# Altium schematic sheet 0203_BLANK.SchDoc
size 848 x 558 mm
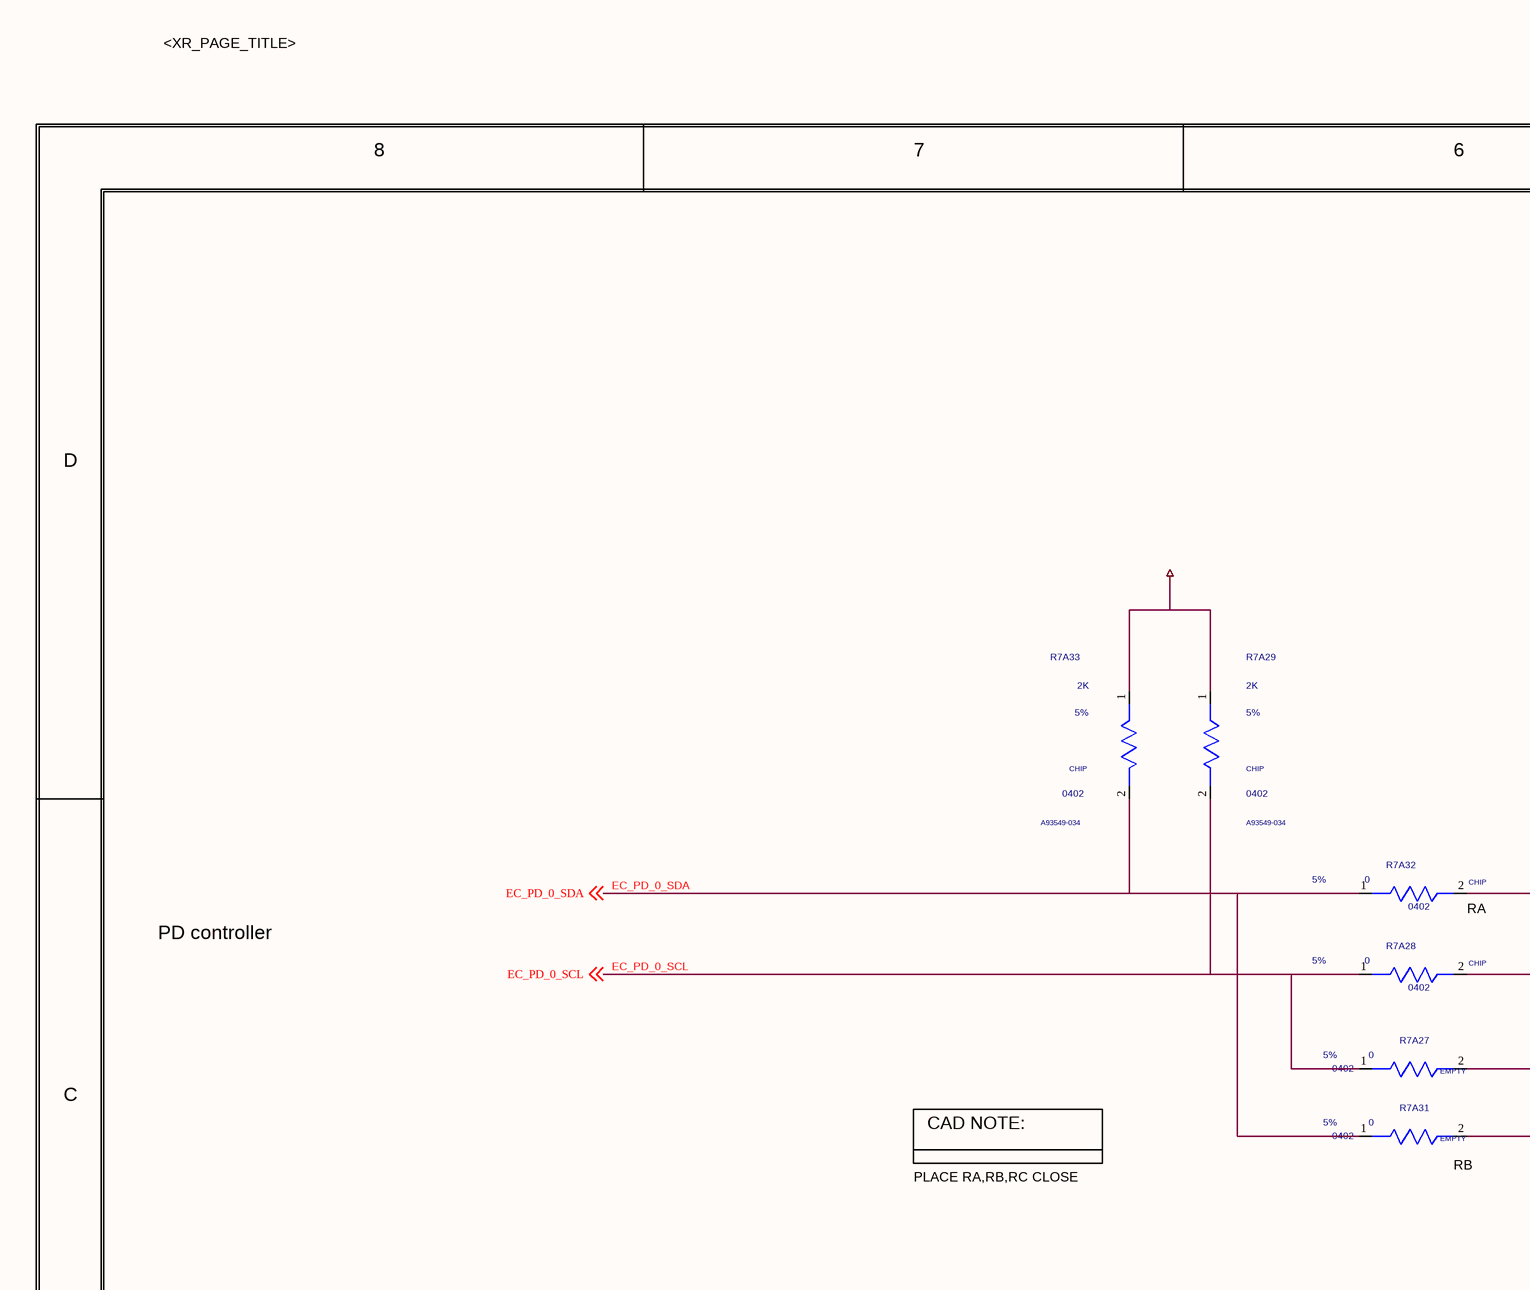
[diagram p0: 0203_BLANK.SchDoc, top left]
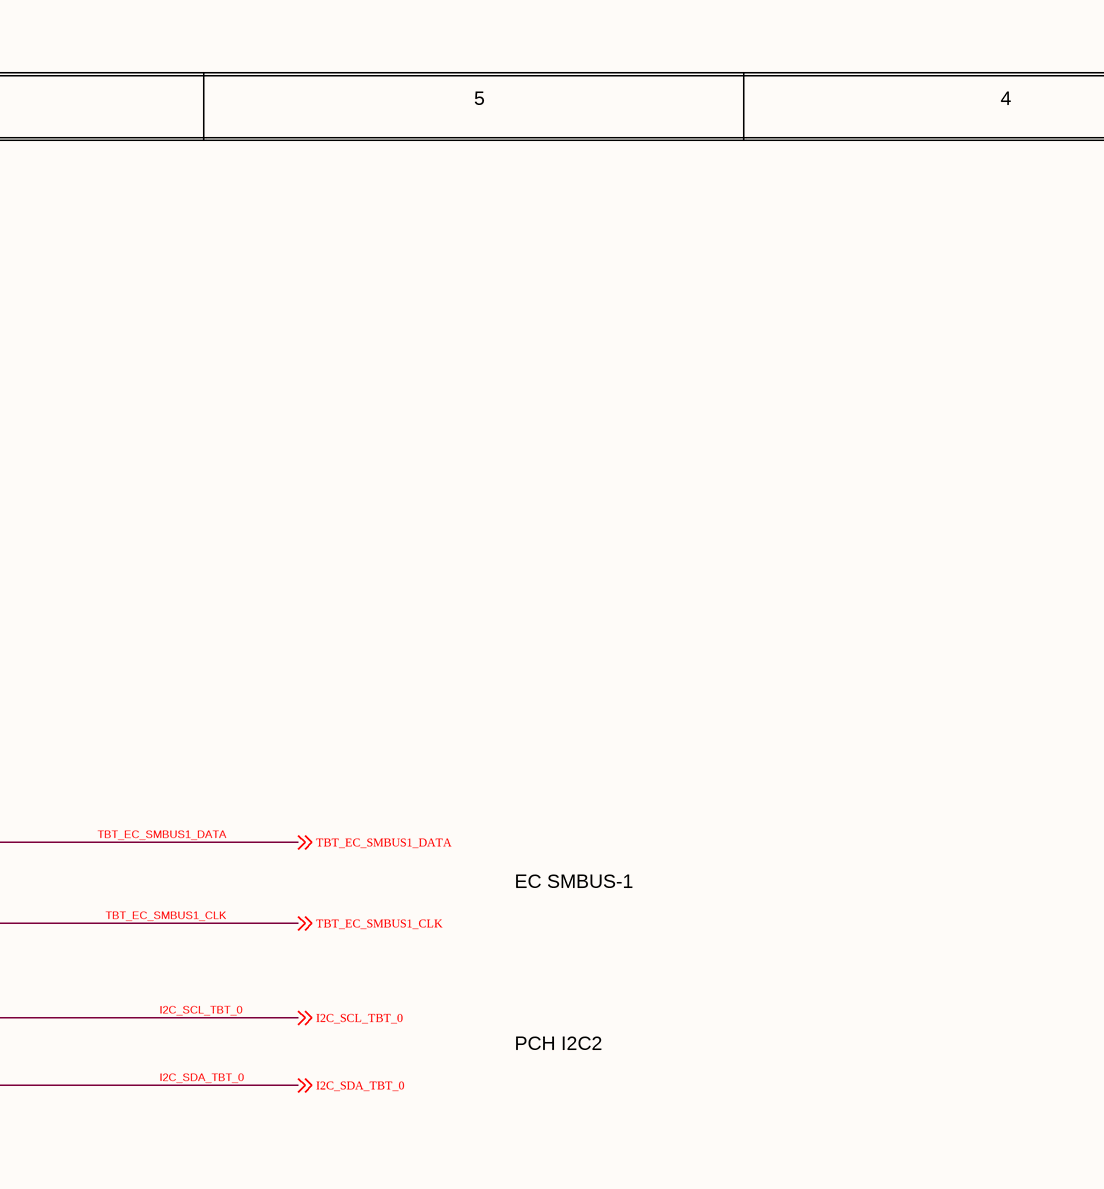
[diagram p1: 0203_BLANK.SchDoc, top middle]
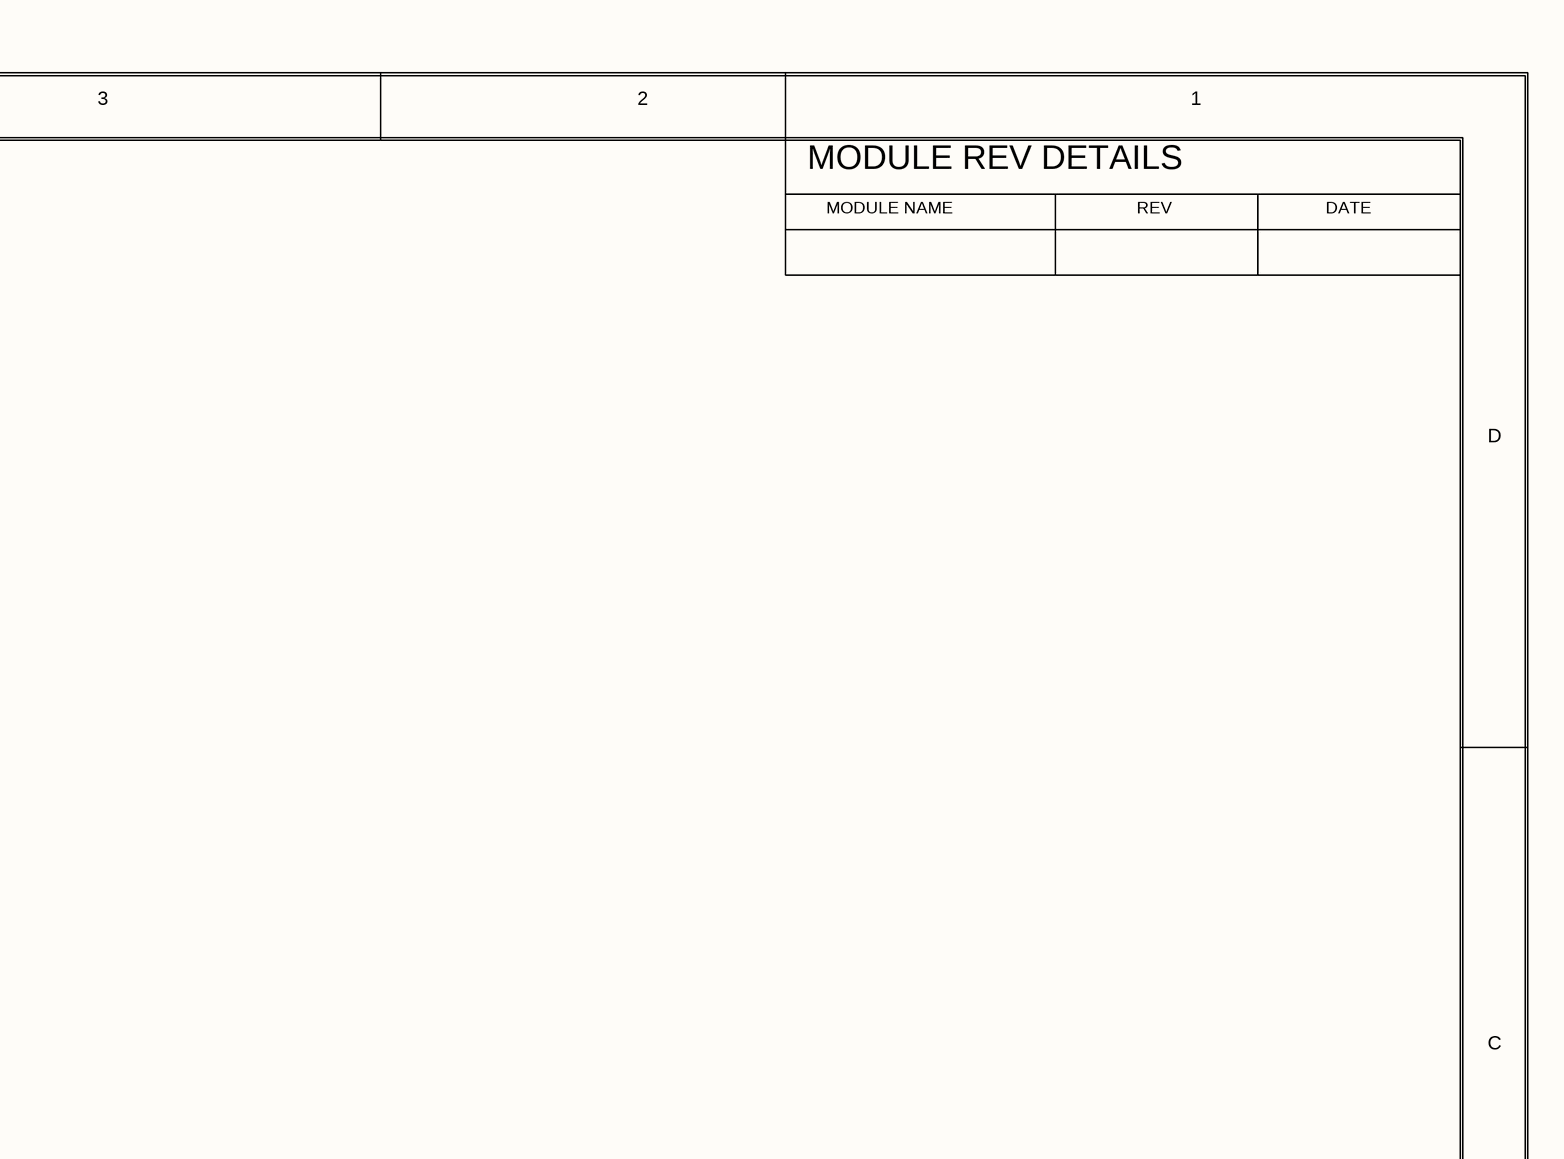
[diagram p2: 0203_BLANK.SchDoc, top right]
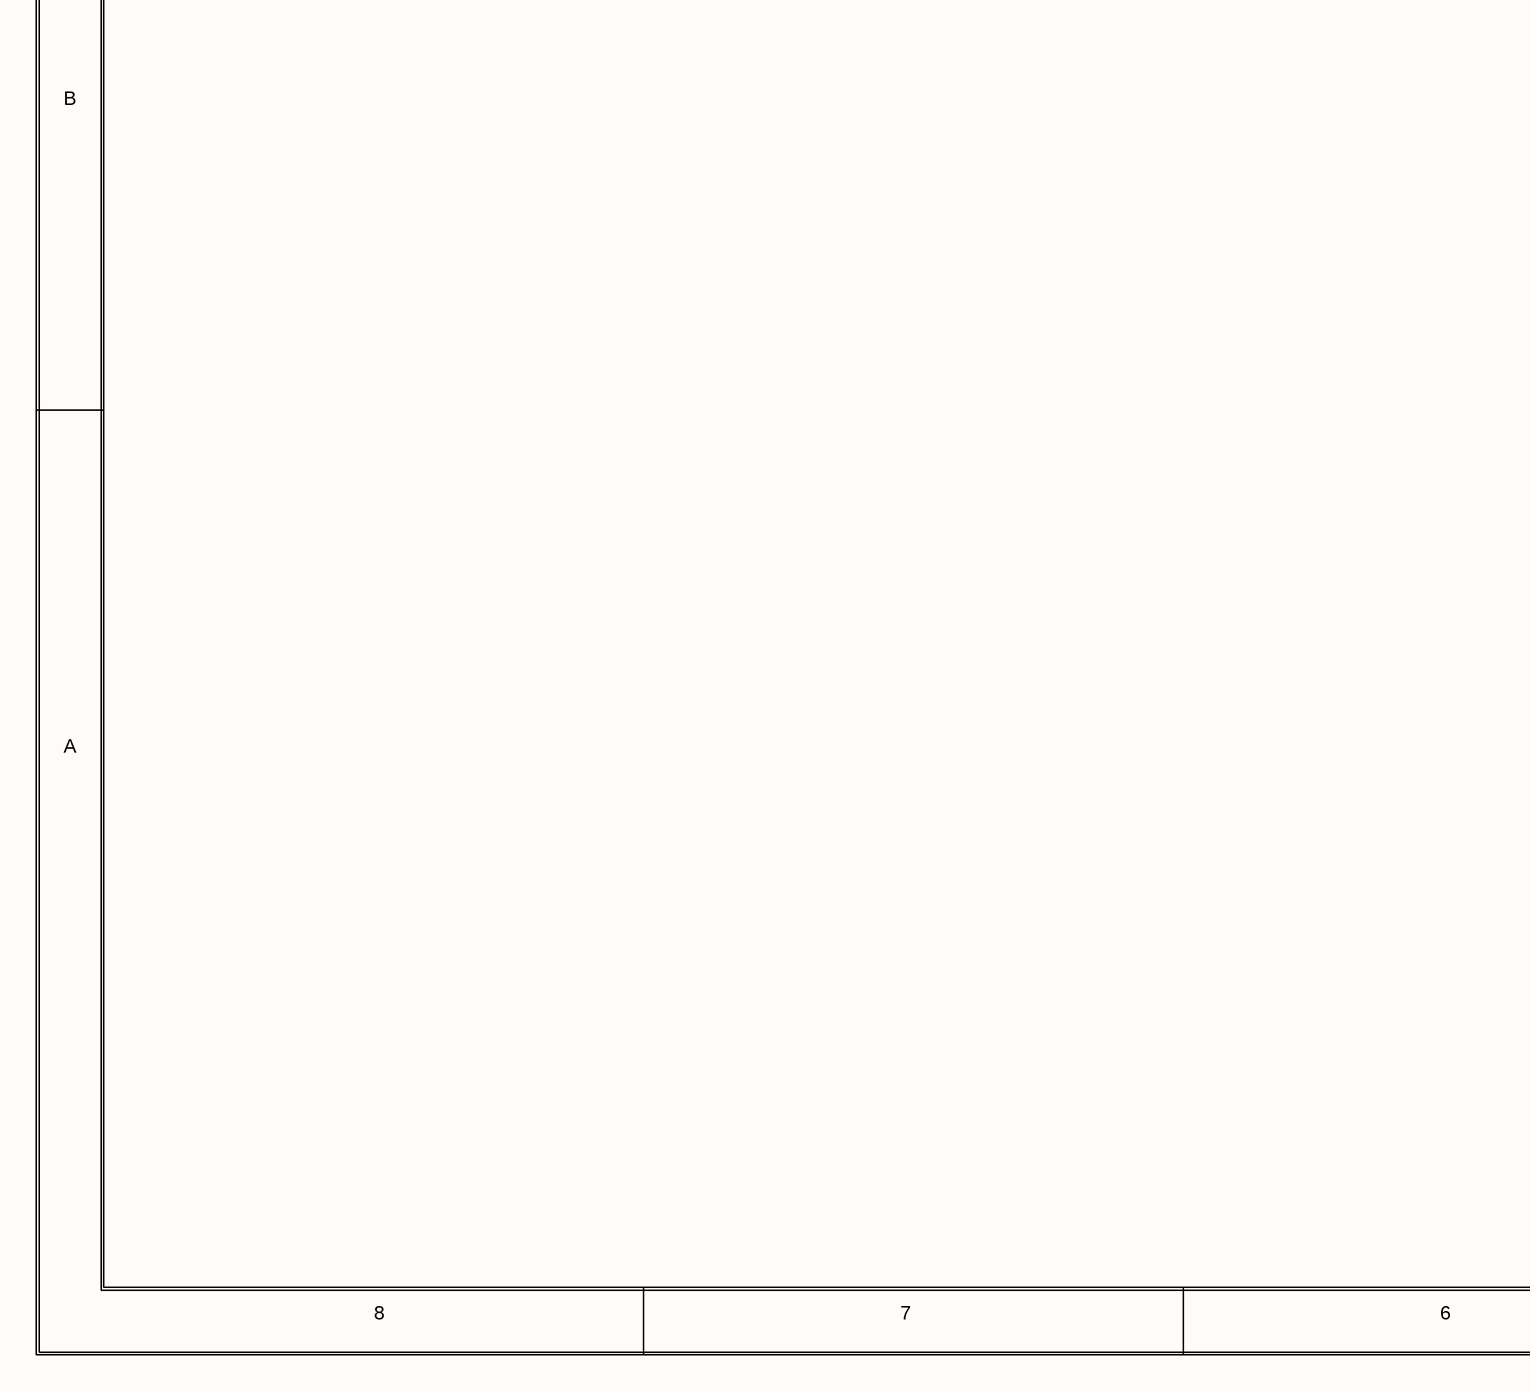
[diagram p3: 0203_BLANK.SchDoc, bottom left]
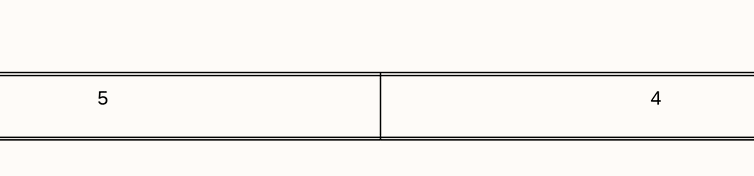
[diagram p4: 0203_BLANK.SchDoc, bottom middle]
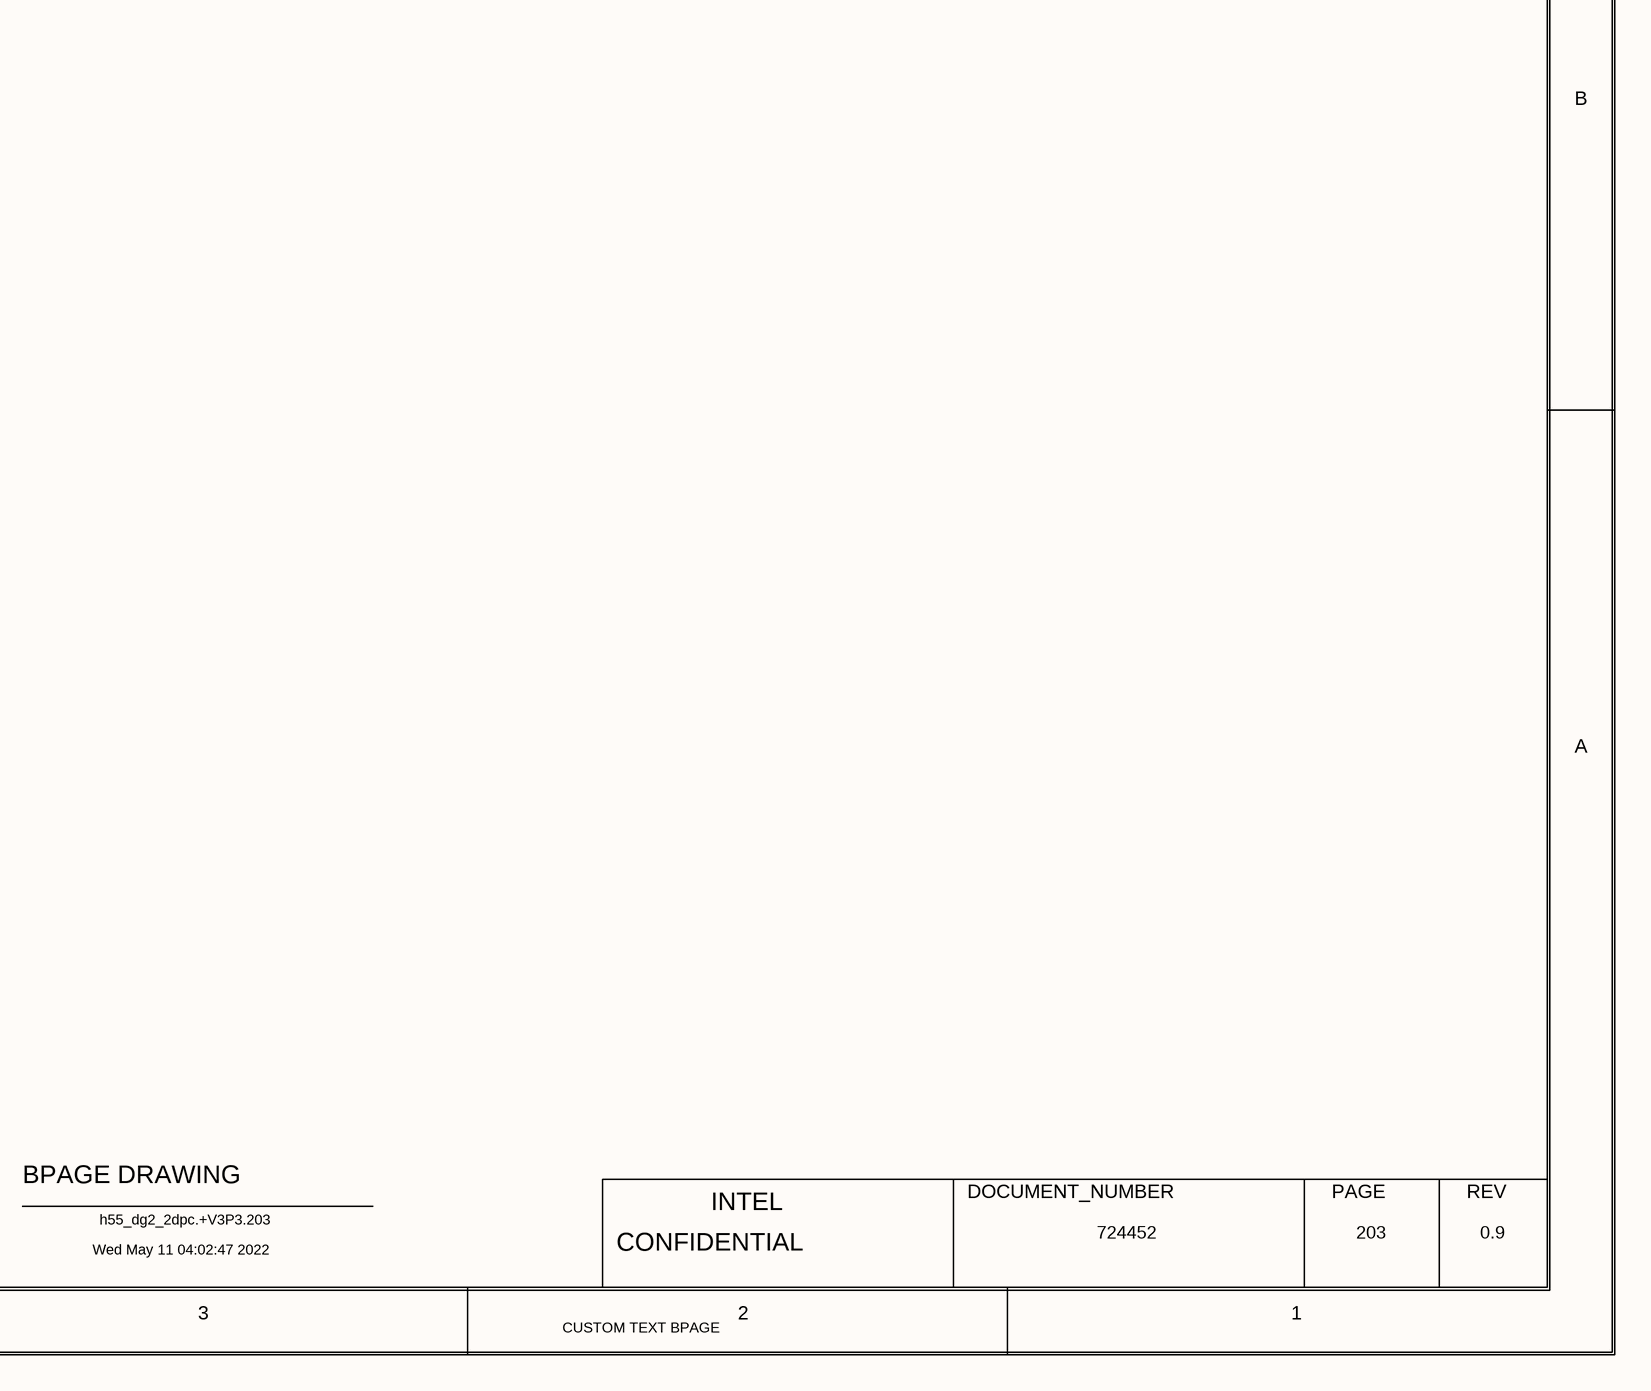
[diagram p5: 0203_BLANK.SchDoc, bottom right]

## Parts
R7A27  0  MATERIAL: EMPTY  PACK_TYPE: 0402  TOLERANCE: 5%  [SMR0402IA]
R7A28  0  MATERIAL: CHIP  PACK_TYPE: 0402  TOLERANCE: 5%  [SMR0402IA]
R7A29  2K  MATERIAL: CHIP  PACK_TYPE: 0402  PART_NUMBER: A93549-034  TOLERANCE: 5%  [SMR0402IA]
R7A31  0  MATERIAL: EMPTY  PACK_TYPE: 0402  TOLERANCE: 5%  [SMR0402IA]
R7A32  0  MATERIAL: CHIP  PACK_TYPE: 0402  TOLERANCE: 5%  [SMR0402IA]
R7A33  2K  MATERIAL: CHIP  PACK_TYPE: 0402  PART_NUMBER: A93549-034  TOLERANCE: 5%  [SMR0402IA]

## Nets
+V3P3A_KBC: R7A29.1(A) R7A33.1(A)
EC_PD_0_SCL: R7A27.1(A) R7A28.1(A) R7A29.2(B) ; off-sheet EC_PD_0_SCL
EC_PD_0_SDA: R7A31.1(A) R7A32.1(A) R7A33.2(B) ; off-sheet EC_PD_0_SDA
I2C_SCL_TBT_0: R7A27.2(B) ; off-sheet I2C_SCL_TBT_0
I2C_SDA_TBT_0: R7A31.2(B) ; off-sheet I2C_SDA_TBT_0
TBT_EC_SMBUS1_CLK: R7A28.2(B) ; off-sheet TBT_EC_SMBUS1_CLK
TBT_EC_SMBUS1_DATA: R7A32.2(B) ; off-sheet TBT_EC_SMBUS1_DATA

## Notes on the sheet
- <XR_PAGE_TITLE>
- 8
- 7
- 6
- 5
- 4
- 3
- 2
- 1
- MODULE REV DETAILS
- MODULE NAME
- REV
- DATE
- D
- (near R7A32) RA
- PD controller
- EC SMBUS-1
- C
- CAD NOTE:
- PCH I2C2
- PLACE RA,RB,RC CLOSE
- (near R7A31) RB
- B
- A
- BPAGE DRAWING
- INTEL
- DOCUMENT_NUMBER
- PAGE
- Wed May 11 04:02:47 2022
- h55_dg2_2dpc.+V3P3.203
- CONFIDENTIAL
- 724452
- 203
- 0.9
- CUSTOM TEXT BPAGE

## Library data of the parts
R7A27 = RES#1: PART_NUMBER: A93549-001; CHIPS_PART_NAME: RES; CDS_PHYS_PART_NAME: RES_0402-A93549-001,EMPTY,0,5%,1/16W,LPDB,GENERIC; WATTAGE: 1/16W; OriginalSymbolOrigin: (-75,25); XY: (-5575,3375); VER: 1; PHYS_PAGE: 203; LOCATION: R7A27; DRAWING: @RVP1_ADL_SB_ADP_S_DDR5_SODIMM_2DPC_LIB.H55_DG2_2DPC(SCH_1):PAGE572; CDS_LIB: discrete; PCB Footprint: SMR0402IA; SEC_TYPE: 0402; ROT: 0; CDS_PART_NAME: RES_0402-A93549-001,EMPTY,0,5%,1/16W,LPDB,GENERIC; CDS_LOCATION: R7A27; ASI_MODEL: A93549-001
R7A28 = RES#1: PART_NUMBER: A93549-001; CHIPS_PART_NAME: RES; CDS_PHYS_PART_NAME: RES_0402-A93549-001,CHIP,0,5%,1/16W,LPDB,GENERIC; WATTAGE: 1/16W; OriginalSymbolOrigin: (-75,25); XY: (-5575,3550); VER: 1; PHYS_PAGE: 203; LOCATION: R7A28; IP: GENERIC; FP_TECH: LPDB; DRAWING: @RVP1_ADL_SB_ADP_S_DDR5_SODIMM_2DPC_LIB.H55_DG2_2DPC(SCH_1):PAGE572; CDS_LIB: discrete; PCB Footprint: SMR0402IA; SEC_TYPE: 0402; ROT: 0; CDS_PART_NAME: RES_0402-A93549-001,CHIP,0,5%,1/16W,LPDB,GENERIC; CDS_LOCATION: R7A28; ASI_MODEL: A93549-001
R7A29 = RES: CDS_PHYS_PART_NAME: RES_0402-A93549-034,CHIP,2K,5%,1/16W,LPDB,GENERIC; WATTAGE: 1/16W; OriginalSymbolOrigin: (-25,75); XY: (-5950,3975); VER: 2; ROT: 0; PHYS_PAGE: 203; LOCATION: R7A29; IP: GENERIC; FP_TECH: LPDB; DRAWING: @RVP1_ADL_SB_ADP_S_DDR5_SODIMM_2DPC_LIB.H55_DG2_2DPC(SCH_1):PAGE572; CDS_LIB: discrete; PCB Footprint: SMR0402IA; CHIPS_PART_NAME: RES; CDS_PART_NAME: RES_0402-A93549-034,CHIP,2K,5%,1/16W,LPDB,GENERIC; CDS_LOCATION: R7A29
R7A31 = RES#1: PART_NUMBER: A93549-001; CHIPS_PART_NAME: RES; CDS_PHYS_PART_NAME: RES_0402-A93549-001,EMPTY,0,5%,1/16W,LPDB,GENERIC; WATTAGE: 1/16W; OriginalSymbolOrigin: (-75,25); XY: (-5575,3250); VER: 1; PHYS_PAGE: 203; LOCATION: R7A31; DRAWING: @RVP1_ADL_SB_ADP_S_DDR5_SODIMM_2DPC_LIB.H55_DG2_2DPC(SCH_1):PAGE572; CDS_LIB: discrete; PCB Footprint: SMR0402IA; SEC_TYPE: 0402; ROT: 0; CDS_PART_NAME: RES_0402-A93549-001,EMPTY,0,5%,1/16W,LPDB,GENERIC; CDS_LOCATION: R7A31; ASI_MODEL: A93549-001
R7A32 = RES#1: PART_NUMBER: A93549-001; CHIPS_PART_NAME: RES; CDS_PHYS_PART_NAME: RES_0402-A93549-001,CHIP,0,5%,1/16W,LPDB,GENERIC; WATTAGE: 1/16W; OriginalSymbolOrigin: (-75,25); XY: (-5575,3700); VER: 1; PHYS_PAGE: 203; LOCATION: R7A32; IP: GENERIC; FP_TECH: LPDB; DRAWING: @RVP1_ADL_SB_ADP_S_DDR5_SODIMM_2DPC_LIB.H55_DG2_2DPC(SCH_1):PAGE572; CDS_LIB: discrete; PCB Footprint: SMR0402IA; SEC_TYPE: 0402; ROT: 0; CDS_PART_NAME: RES_0402-A93549-001,CHIP,0,5%,1/16W,LPDB,GENERIC; CDS_LOCATION: R7A32; ASI_MODEL: A93549-001
R7A33 = RES: CDS_PHYS_PART_NAME: RES_0402-A93549-034,CHIP,2K,5%,1/16W,LPDB,GENERIC; WATTAGE: 1/16W; OriginalSymbolOrigin: (-25,75); XY: (-6100,3975); VER: 2; PHYS_PAGE: 203; LOCATION: R7A33; IP: GENERIC; FP_TECH: LPDB; DRAWING: @RVP1_ADL_SB_ADP_S_DDR5_SODIMM_2DPC_LIB.H55_DG2_2DPC(SCH_1):PAGE572; CDS_LIB: discrete; PCB Footprint: SMR0402IA; ROT: 2; CHIPS_PART_NAME: RES; CDS_PART_NAME: RES_0402-A93549-034,CHIP,2K,5%,1/16W,LPDB,GENERIC; CDS_LOCATION: R7A33